# Altium project trusted_io_dvt1.PrjPcb (part 2 of 2)

## Sheet 04_io.SchDoc
size B
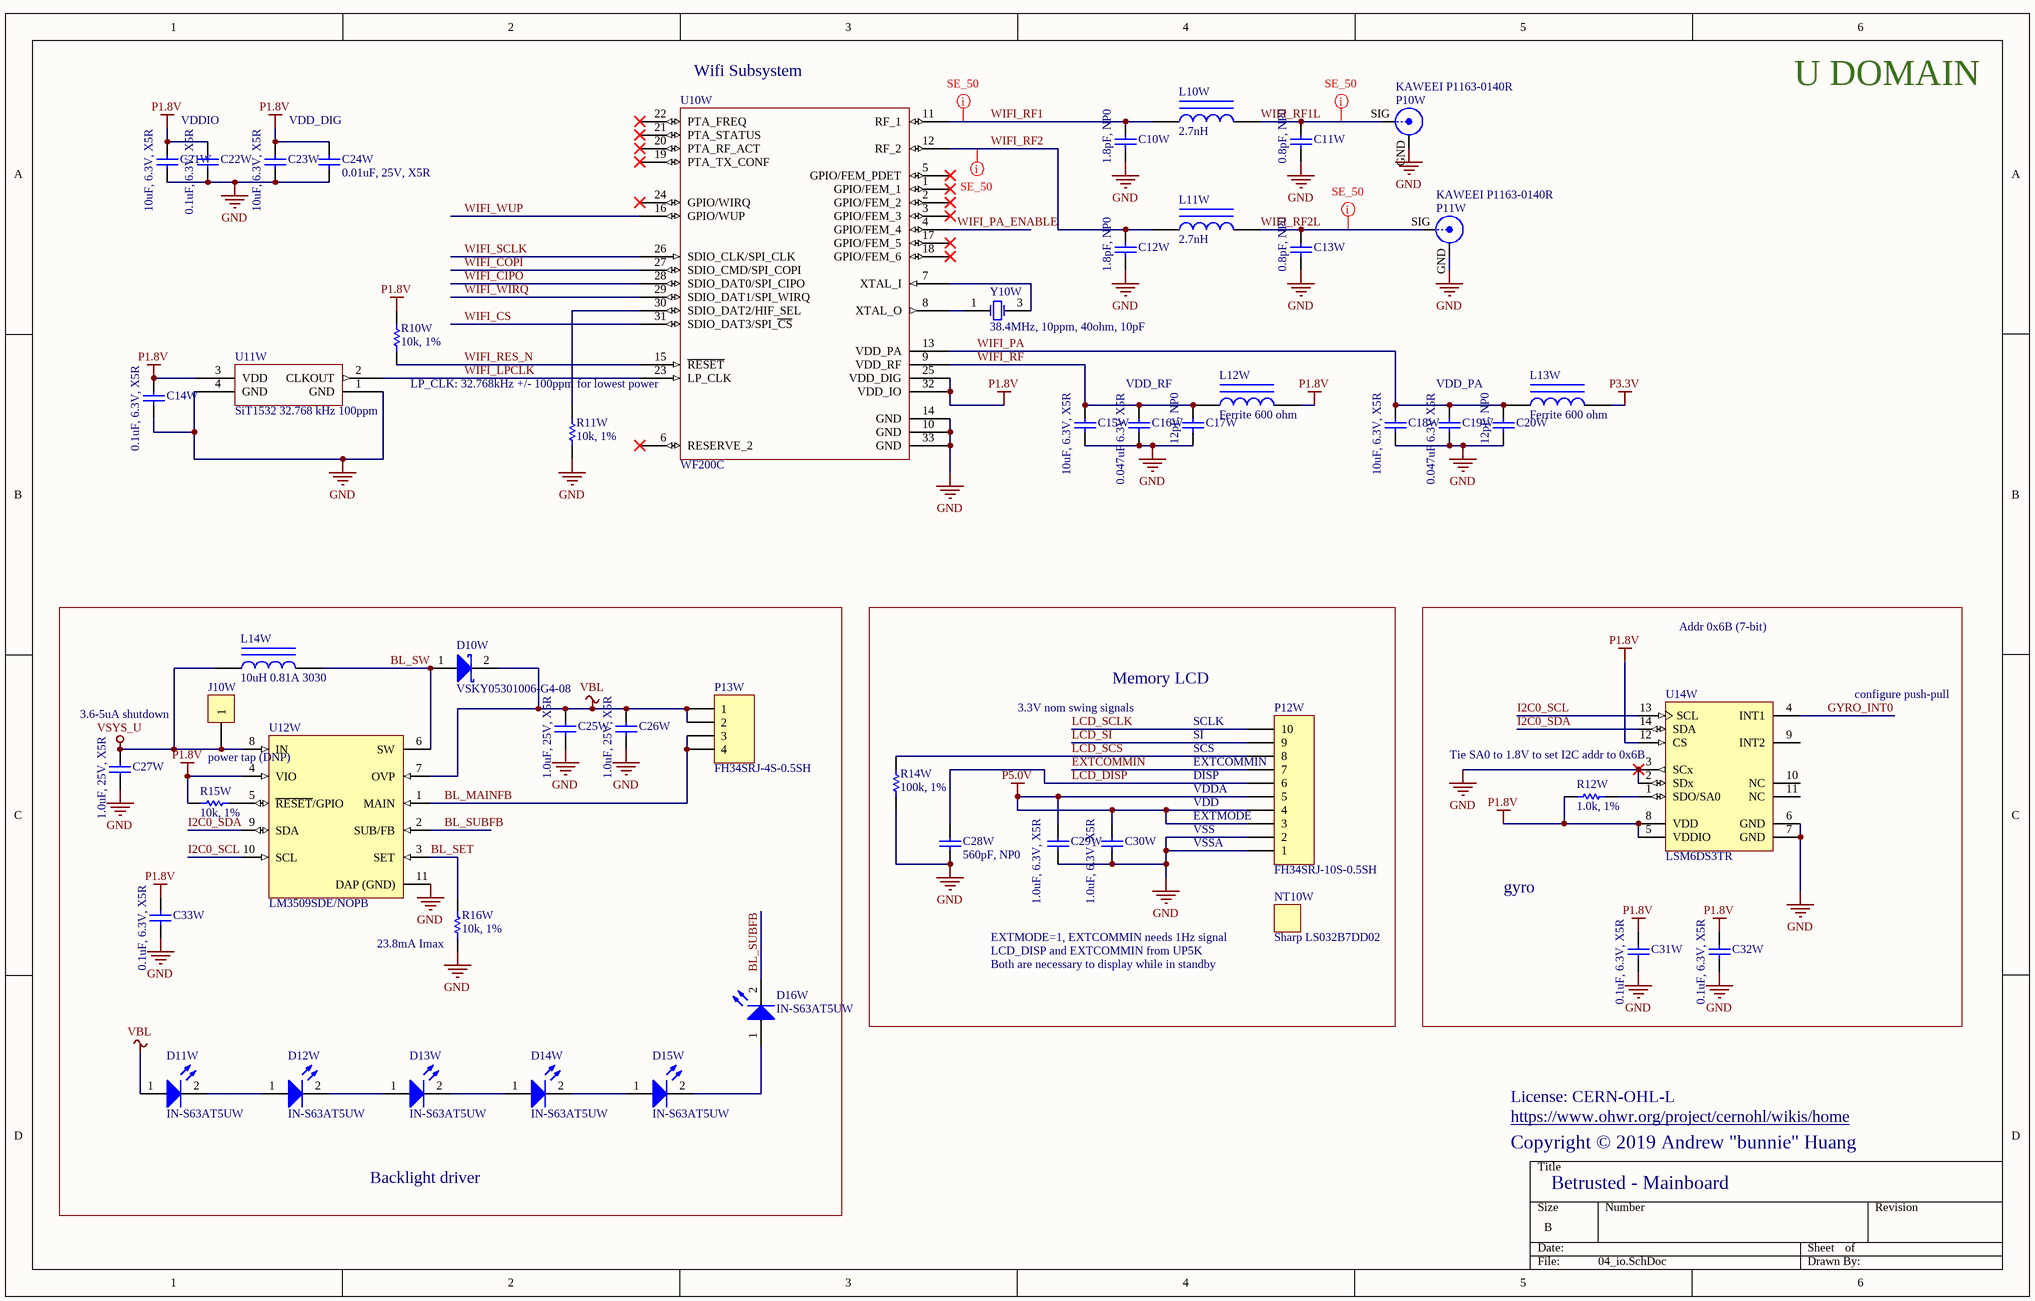
[diagram p5: 04_io.SchDoc]

### Parts
C10W  1.8pF, NP0  [B_CAP0201]
C11W  0.8pF, NP0  [B_CAP0201]
C12W  1.8pF, NP0  [B_CAP0201]
C13W  0.8pF, NP0  [B_CAP0201]
C14W  0.1uF, 6.3V, X5R  [B_CAP0201]
C15W  10uF, 6.3V, X5R  [B_CAP0603]
C16W  0.047uF 6.3V X5R  [B_CAP0201]
C17W  12pF, NP0  [B_CAP0201]
C18W  10uF, 6.3V, X5R  [B_CAP0603]
C19W  0.047uF 6.3V X5R  [B_CAP0201]
C20W  12pF, NP0  [B_CAP0201]
C21W  10uF, 6.3V, X5R  [B_CAP0603]
C22W  0.1uF, 6.3V, X5R  [B_CAP0201]
C23W  10uF, 6.3V, X5R  [B_CAP0603]
C24W  0.01uF, 25V, X5R  [B_RES0201]
C25W  1.0uF, 25V, X5R  [B_CAP0603]
C26W  1.0uF, 25V, X5R  [B_CAP0603]
C27W  1.0uF, 25V, X5R  [B_CAP0603]
C28W  560pF, NP0  [B_RES0201]
C29W  1.0uF, 6.3V, X5R  [B_CAP0201]
C30W  1.0uF, 6.3V, X5R  [B_CAP0201]
C31W  0.1uF, 6.3V, X5R  [B_CAP0201]
C32W  0.1uF, 6.3V, X5R  [B_CAP0201]
C33W  0.1uF, 6.3V, X5R  [B_CAP0201]
D10W  VSKY05301006-G4-08  [B_DIO0402]
D11W  IN-S63AT5UW  [B_DIO0603]
D12W  IN-S63AT5UW  [B_DIO0603]
D13W  IN-S63AT5UW  [B_DIO0603]
D14W  IN-S63AT5UW  [B_DIO0603]
D15W  IN-S63AT5UW  [B_DIO0603]
D16W  IN-S63AT5UW  [B_DIO0603]
J10W  power tap (DNP)  [RESTAP-0603]
L10W  2.7nH  [B_IND0402]
L11W  2.7nH  [B_IND0402]
L12W  Ferrite 600 ohm  [B_IND0603]
L13W  Ferrite 600 ohm  [B_IND0603]
L14W  10uH 0.81A 3030  [B_IND3030_MUR]
NT10W  Sharp LS032B7DD02
P10W  KAWEEI P1163-0140R  [HRS_U.FL]
P11W  KAWEEI P1163-0140R  [HRS_U.FL]
P12W  FH34SRJ-10S-0.5SH  [HRS_FH34SRJ-10S-0.5SH(50)]
P13W  FH34SRJ-4S-0.5SH  [HRS_FH34SRJ-4S-0.5SH(50)]
R10W  10k, 1%  [B_RES0201]
R11W  10k, 1%  [B_RES0201]
R12W  1.0k, 1%  [B_RES0201]
R14W  100k, 1%  [B_RES0201]
R15W  10k, 1%  [B_RES0201]
R16W  10k, 1%  [B_RES0201]
U10W  WF200C  [QFN40P400X400X90_HS-33N]
U11W  SiT1532 32.768 kHz 100ppm  [SiTIME_CSP]
U12W  LM3509SDE/NOPB  [DSC0010A_V]
U14W  LSM6DS3TR  [LGA-14_2500X3000X860_N]
Y10W  38.4MHz, 10ppm, 40ohm, 10pF  [XOSC_3.2_2.5]

### Blocks framed on the sheet
Backlight driver: C25W C26W C27W C33W D10W D11W D12W D13W D14W D15W D16W J10W L14W P13W R15W R16W U12W
Memory LCD: C28W C29W C30W NT10W P12W R14W
gyro: C31W C32W R12W U14W

### Nets
GND: C10W.2 C11W.2 C12W.2 C13W.2 C14W.2 C15W.2 C16W.2 C17W.2 C18W.2 C19W.2 C20W.2 C21W.2 C22W.2 C23W.2 C24W.2 C25W.2 C26W.2 C27W.2 C28W.2 C29W.1 C30W.1 C31W.2 C32W.2 C33W.2 P10W.GND(Y) P11W.GND(Y) P12W.1 P12W.2 R11W.2 R14W.1 R16W.2 U10W.10(GND) U10W.14(GND) U10W.33(GND) U11W.1(GND) U11W.4(GND) U12W.11(DAP_(GND)) U14W.2(SDx) U14W.3(SCx) U14W.6(GND) U14W.7(GND)
P1.8V: C14W.1 C21W.1 C22W.1 C23W.1 C24W.1 C31W.1 C32W.1 C33W.1 L12W.2 R10W.1 R12W.2 R15W.1 U10W.25(VDD_DIG) U10W.32(VDD_IO) U11W.3(VDD) U12W.4(VIO) U14W.5(VDDIO) U14W.8(VDD) U14W.12(CS)
P3.3V: L13W.2
P5.0V: C29W.2 C30W.2 P12W.3 P12W.4 P12W.5
VBL: C25W.1 C26W.1 D10W.2(K) D11W.1(A) P13W.1 P13W.2 U12W.7(OVP)
VSYS_U: C27W.1 J10W.1 L14W.1 U12W.8(IN)
BL_MAINFB: P13W.3 P13W.4 U12W.1(MAIN)
BL_SET: R16W.1 U12W.3(SET)
BL_SUBFB: D16W.2(K) U12W.2(SUB/FB)
BL_SW: D10W.1(A) L14W.2 U12W.6(SW)
EXTCOMMIN: P12W.7
GYRO_INT0: U14W.4(INT1)
I2C0_SCL: U12W.10(SCL) U14W.13(SCL)
I2C0_SDA: U12W.9(SDA) U14W.14(SDA)
LCD_DISP: C28W.1 P12W.6
LCD_SCLK: P12W.10
LCD_SCS: P12W.8 R14W.2
LCD_SI: P12W.9
WIFI_CIPO: U10W.28(SDIO_DAT0/SPI_CIPO)
WIFI_COPI: U10W.27(SDIO_CMD/SPI_COPI)
WIFI_CS: U10W.31(SDIO_DAT3/SPI_~{CS})
WIFI_LPCLK: U10W.23(LP_CLK) U11W.2(CLKOUT)
WIFI_PA: C18W.1 C19W.1 C20W.1 L13W.1 U10W.13(VDD_PA)
WIFI_PA_ENABLE: U10W.4(GPIO/FEM_4)
WIFI_RES_N: R10W.2 U10W.15(~{RESET})
WIFI_RF: C15W.1 C16W.1 C17W.1 L12W.1 U10W.9(VDD_RF)
WIFI_RF1: C10W.1 L10W.1 U10W.11(RF_1)
WIFI_RF1L: C11W.1 L10W.2 P10W.SIG(X)
WIFI_RF2: C12W.1 L11W.1 U10W.12(RF_2)
WIFI_RF2L: C13W.1 L11W.2 P11W.SIG(X)
WIFI_SCLK: U10W.26(SDIO_CLK/SPI_CLK)
WIFI_WIRQ: U10W.29(SDIO_DAT1/SPI_WIRQ)
WIFI_WUP: U10W.16(GPIO/WUP)
NetD11W_2: D11W.2(K) D12W.1(A)
NetD12W_2: D12W.2(K) D13W.1(A)
NetD13W_2: D13W.2(K) D14W.1(A)
NetD14W_2: D14W.2(K) D15W.1(A)
NetD15W_2: D15W.2(K) D16W.1(A)
NetR11W_1: R11W.1 U10W.30(SDIO_DAT2/HIF_SEL)
NetR12W_1: R12W.1 U14W.1(SDO/SA0)
NetR15W_2: R15W.2 U12W.5(~{RESET}/GPIO)
NetU10W_7: U10W.7(XTAL_I) Y10W.3(OSC2)
NetU10W_8: U10W.8(XTAL_O) Y10W.1(OSC1)

Not connected (* = marked no-connect by the designer): U10W 1(GPIO/FEM_1)* 2(GPIO/FEM_2)* 3(GPIO/FEM_3)* 5(GPIO/FEM_PDET)* 6(RESERVE_2)* 17(GPIO/FEM_5)* 18(GPIO/FEM_6)* 19(PTA_TX_CONF)* 20(PTA_RF_ACT)* 21(PTA_STATUS)* 22(PTA_FREQ)* 24(GPIO/WIRQ)*; U14W 9(INT2) 10(NC) 11(NC)

### Layout directives
net class SE_50: WIFI_RF1, WIFI_RF1L, WIFI_RF2, WIFI_RF2L

### Notes on the sheet
- (near U10W) Wifi Subsystem
- U DOMAIN
- VDDIO
- VDD_DIG
- (near U10W) LP_CLK: 32.768kHz +/- 100ppm for lowest power
- VDD_RF
- VDD_PA
- Addr 0x6B (7-bit)
- 3.3V nom swing signals
- configure push-pull
- 3.6-5uA shutdown
- SCLK
- SI
- SCS
- (near P12W) EXTCOMMIN
- DISP
- (near U14W) Tie SA0 to 1.8V to set I2C addr to 0x6B
- VDDA
- VDD
- (near P12W) EXTMODE
- VSS
- VSSA
- (near R16W) 23.8mA Imax
- EXTMODE=1, EXTCOMMIN needs 1Hz signal
- LCD_DISP and EXTCOMMIN from UP5K
- (near NT10W) Both are necessary to display while in standby
- License: CERN-OHL-L
- Copyright © 2019 Andrew "bunnie" Huang
- https://www.ohwr.org/project/cernohl/wikis/home
- Betrusted - Mainboard

### Library data of the parts
C10W C12W = Cap Semi: Capacitor (Semiconductor SIM Model); MPN: GRM0335C1H1R8BA01D; VENDOR: Murata; MYPN: C-1R8-50-NP0-0201
C11W C13W = Cap Semi: Capacitor (Semiconductor SIM Model); MPN: GRM0335C1ER80BA01D; VENDOR: Murata; MYPN: C-0R8-25-NP0-0201
C14W C22W C31W C32W C33W = Cap Semi: as C12F on sheet 01_fpga
C15W C18W C21W C23W = Cap Semi: as C11F on sheet 01_fpga
C16W C19W = Cap Semi: Capacitor (Semiconductor SIM Model); MPN: GRM033C81A473KE05D; VENDOR: Murata; MYPN: C-473-10-X6S-0201
C17W C20W = Cap Semi: Capacitor (Semiconductor SIM Model); MPN: GRM0335C1E120JA01D; VENDOR: Murata; MYPN: C-120-25-NP0-0201
C24W = Cap Semi: as C35F on sheet 01_fpga
C25W C26W C27W = Cap Semi: Capacitor (Semiconductor SIM Model); MPN: CL10A105KA8NNNC; VENDOR: Samsung; MYPN: C-105-25-X5R-0603
C28W = Cap Semi: Capacitor (Semiconductor SIM Model); MPN: GRM0335C1E561JA01D; VENDOR: Murata; MYPN: C-561-25-NP0-0201
C29W C30W = Cap Semi: as C22F on sheet 01_fpga
D10W = Diode 11DQ03: as D? on sheet 03_power; ComponentLink1Description: Manufacturer Link; ComponentLink1URL: http://www.irf.com/; ComponentLink2Description: Datasheet; ComponentLink2URL: http://www.irf.com/product-info/datasheets/data/11dq03.pdf; MPN: VSKY05301006-G4-08
D11W D12W D13W D14W D15W D16W = LED2: White LED, 0603, 900mcd, 0.4mm; MYPN: D-LED-WHT-0603-0.4mm; VENDOR: Inolux; Published: 8-Jun-2000; LatestRevisionDate: 17-Jul-2002; LatestRevisionNote: Re-released for DXP Platform.; PackageVersion: Feb-2002; PackageReference: 3.2X1.6X1.1; Publisher: Altium Limited; MPN: IN-S63AT5UW
J10W = CON1: Connector; MYPN: J-TP-PWRTAP-0603; MPN: DNP; VENDOR: DNP
L10W L11W = Inductor Iron: Magnetic-Core Inductor; MPN: LQW15AN2N7C00; VENDOR: Murata; MYPN: L-LQW15AN2N7C00
L12W L13W = Inductor Iron: as L10F on sheet 01_fpga
L14W = Inductor Iron: Magnetic-Core Inductor; MPN: LQH3NPN100MJRL; VENDOR: Murata; MYPN: L-LQH3NPN100MJRL
NT10W = NOTE: Placeholder for non-board BOM items; MYPN: NT-LCD-LS032B7DD02; MPN: LS032B7DD02; VENDOR: Sharp
P10W P11W = BNC: BNC Elbow Connector; MYPN: U.FL-R-SMT-1(10); LatestRevisionDate: 17-Jul-2002; LatestRevisionNote: Re-released for DXP Platform.; Publisher: Altium Limited; MPN: P1163-0140R; VENDOR: Kaweei
P12W = Header 10: Header, 10-Pin; VENDOR: Hirose; MYPN: J-FH34SRJ-10S-0.5SH(50/99); LatestRevisionDate: 17-Jul-2002; LatestRevisionNote: Re-released for DXP Platform.; Publisher: Altium Limited; MPN: FH34SRJ-10S-0.5SH
P13W = Header 4: 4-pin FPC connector; MPN: FH34SRJ-4S-0.5SH(XX); VENDOR: HRS; MYPN: J-FH34SRJ-4S-0.5SH(99); LatestRevisionDate: 17-Jul-2002; LatestRevisionNote: Re-released for DXP Platform.; Publisher: Altium Limited
R10W R11W R15W R16W = Res1: as R27F on sheet 01_fpga; MPN: ANY
R12W = Res1: Resistor; VENDOR: ANY; MYPN: R-102-1P-1_16W-0201; MPN: ANY
R14W = Res1: as R14F on sheet 01_fpga; MPN: ANY
U10W = WF200C(R): Wifi Network Coprocessor; VENDOR: SiLabs; MYPN: U-WF200C(R); MPN: WF200C
U11W = SiT1532: 10ppm ultra low power 32.768 kHz replacement; MPN: SIT1532AI-J4-DCC-32.768E; VENDOR: SiTime; MYPN: U-SIT1532AX-JX-DCC-32.768X
U12W = LM3509SDE/NOPB: MYPN: U-LM3509SDE/NOPB; VENDOR: TI; MPN: LM3509SDE/NOPB
U14W = LSM6DS3TR: iNEMO Inertial Module: Always-on 3D Accelerometer and 3D Gyroscope, 1.71 to 3.6 V, -40 to 85 degC, 14-Pin LGA, RoHS, Tape and Reel; Sensing Distance: 2|4|6|8|16G; Number of Axis: 3; VENDOR: STMicroelectronics; Output Type: Digital; Lead Finish: GoldOverNickel; Max Processing Temp: 260; Screening Level: Industrial; Typical Supply Current: 1.25Milliamps; Operating Supply Voltage: 1.8volt; MYPN: U-LSM6DS3TR; Type: AccelerometerandGyroscope; Datasheet Version: Rev. 8, 02/2016; Datasheet URL: http://www2.st.com/content/ccc/resource/technical/document/datasheet/a3/f5/4f/ae/8e/44/41/d7/DM00133076.pdf/files/DM00133076.pdf/jcr:content/translations/en.DM00133076.pdf; Mounting: SurfaceMount; Manufacturer URL: http://www.st.com/; Operating Temperature: -40to85C; MPN: LSM6DS3TR
Y10W = XTAL: Crystal Oscillator; MPN: ECS-384-10-33B-CKY-TR; VENDOR: ECS; MYPN: X-38.4000-40OHM-10PF-10PPM; Published: 8-Jun-2000; LatestRevisionDate: 17-Jul-2002; LatestRevisionNote: Re-released for DXP Platform.; PackageReference: R38; Publisher: Altium Limited; PackageDescription: Crystal, Thru-Hole; 2 Leads; Body 3.1 x 8.2 mm (Dia.xH)

## Sheet 05_kbd_pm.SchDoc
size B
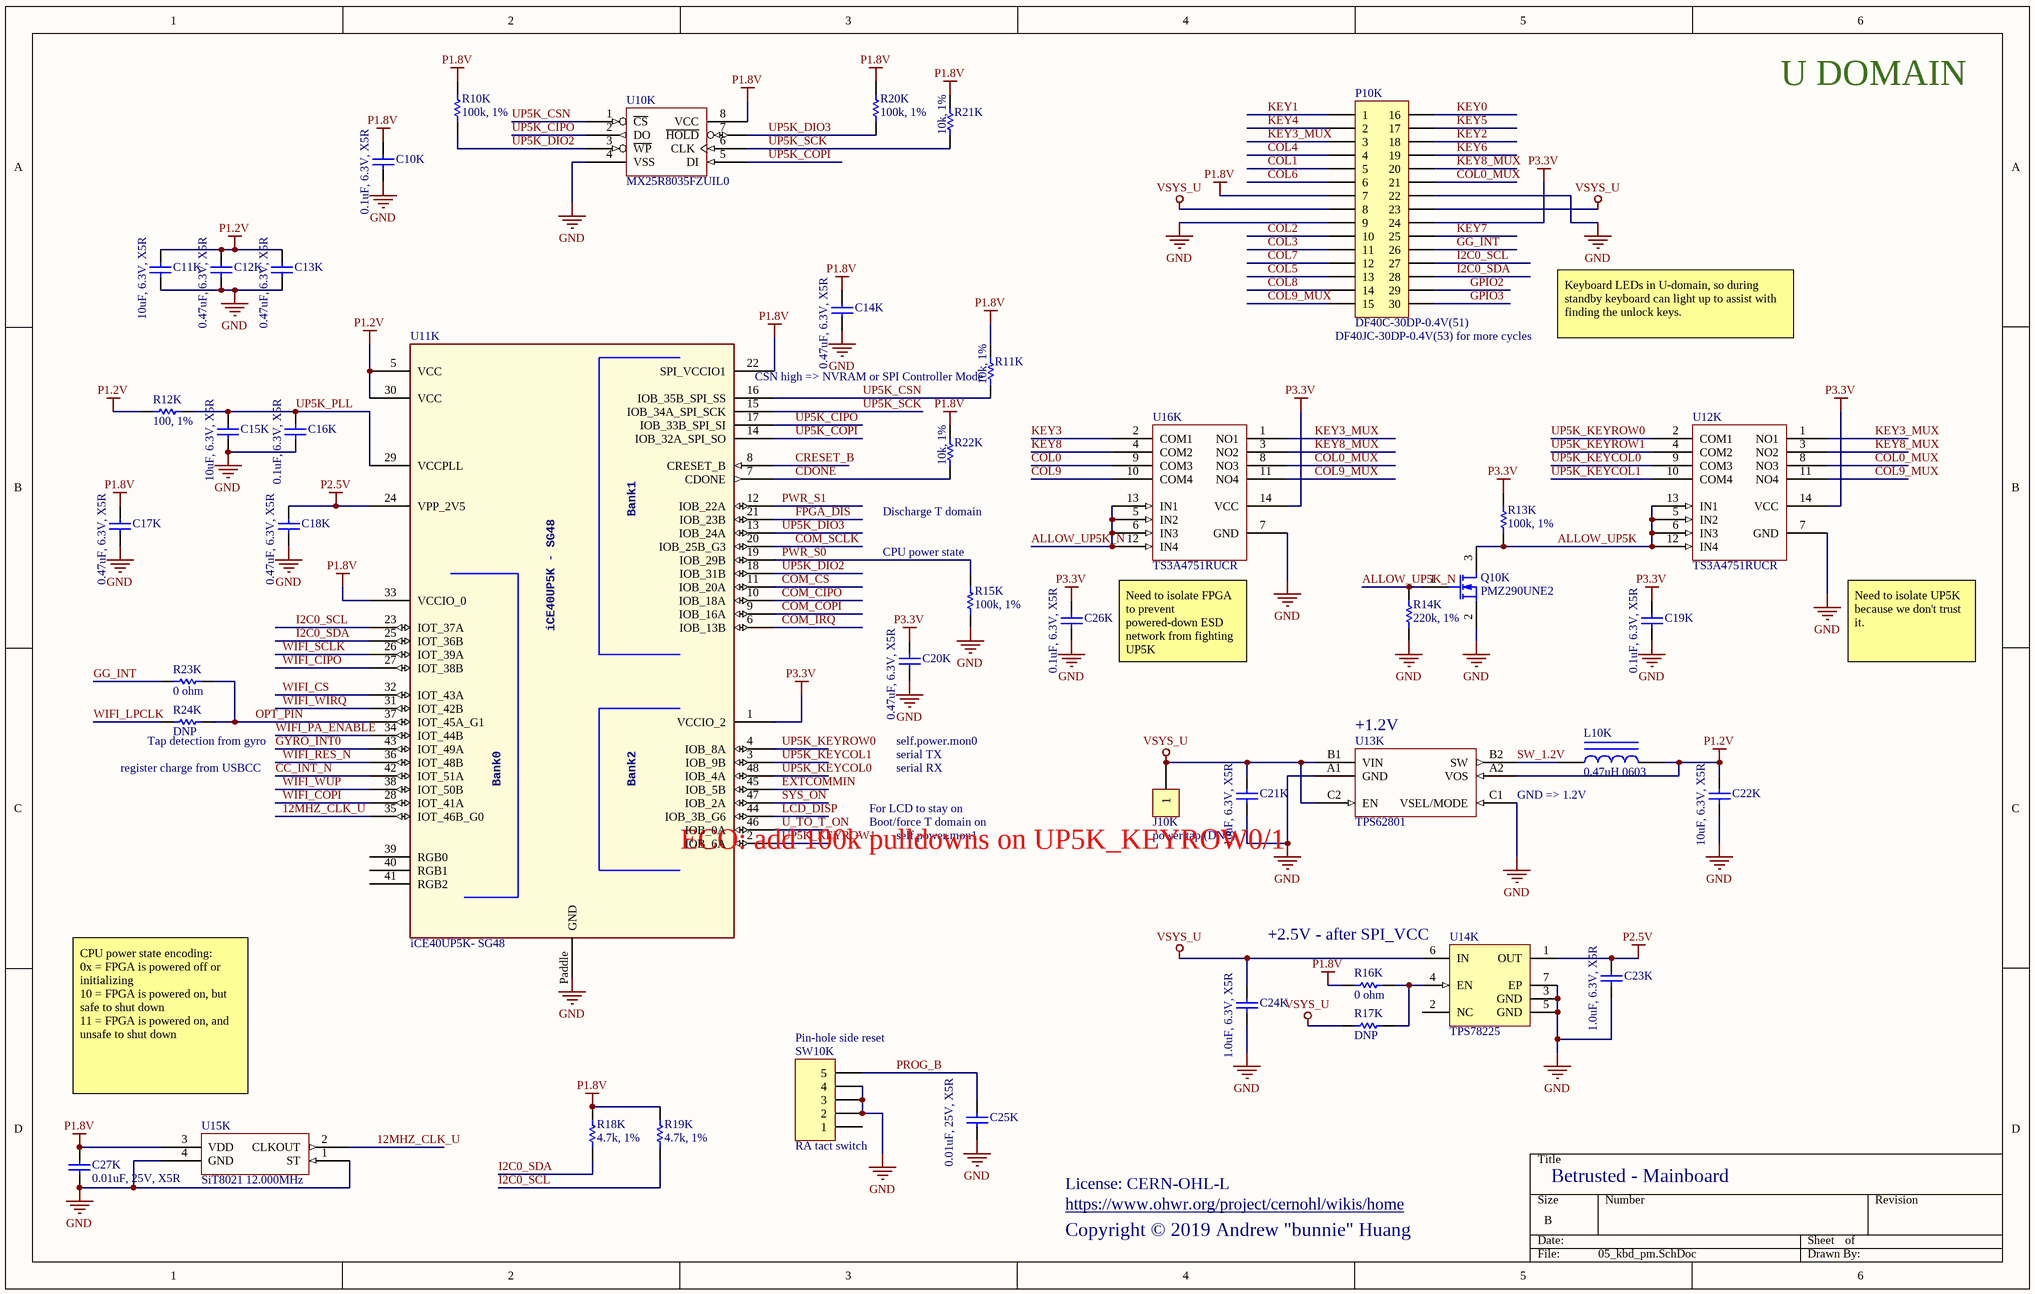
[diagram p6: 05_kbd_pm.SchDoc]

### Parts
C10K  0.1uF, 6.3V, X5R  [B_CAP0201]
C11K  10uF, 6.3V, X5R  [B_CAP0603]
C12K  0.47uF, 6.3V, X5R  [B_CAP0201]
C13K  0.47uF, 6.3V, X5R  [B_CAP0201]
C14K  0.47uF, 6.3V, X5R  [B_CAP0201]
C15K  10uF, 6.3V, X5R  [B_CAP0603]
C16K  0.1uF, 6.3V, X5R  [B_CAP0201]
C17K  0.47uF, 6.3V, X5R  [B_CAP0201]
C18K  0.47uF, 6.3V, X5R  [B_CAP0201]
C19K  0.1uF, 6.3V, X5R  [B_CAP0201]
C20K  0.47uF, 6.3V, X5R  [B_CAP0201]
C21K  10uF, 6.3V, X5R  [B_CAP0603]
C22K  10uF, 6.3V, X5R  [B_CAP0603]
C23K  1.0uF, 6.3V, X5R  [B_CAP0201]
C24K  1.0uF, 6.3V, X5R  [B_CAP0201]
C25K  0.01uF, 25V, X5R  [B_RES0201]
C26K  0.1uF, 6.3V, X5R  [B_CAP0201]
C27K  0.01uF, 25V, X5R  [B_RES0201]
J10K  power tap (DNP)  [RESTAP-0603]
L10K  0.47uH 0603  [B_IND0603]
P10K  DF40C-30DP-0.4V(51)  [HRS_DF40C-30DP-0.4V(51)]
Q10K  PMZ290UNE2  [SOT883]
R10K  100k, 1%  [B_RES0201]
R11K  10k, 1%  [B_RES0201]
R12K  100, 1%  [B_RES0402]
R13K  100k, 1%  [B_RES0201]
R14K  220k, 1%  [B_RES0201]
R15K  100k, 1%  [B_RES0201]
R16K  0 ohm  [B_RES0201]
R17K  DNP  [B_RES0201]
R18K  4.7k, 1%  [B_RES0201]
R19K  4.7k, 1%  [B_RES0201]
R20K  100k, 1%  [B_RES0201]
R21K  10k, 1%  [B_RES0201]
R22K  10k, 1%  [B_RES0201]
R23K  0 ohm  [B_RES0201]
R24K  DNP  [B_RES0201]
SW10K  RA tact switch  [CK_KMS221GPLFS]
U10K  MX25R8035FZUIL0  [USON-8]
U11K  iCE40UP5K- SG48  [UP5K_QFN127P600-8N]
U12K  TS3A4751RUCR  [QFN40P200X200X40-14L]
U13K  TPS62801  [BGA6C35P2X3_70X105X40_NSMD]
U14K  TPS78225  [TI-DRV6-1600X1000TP_V]
U15K  SiT8021 12.000MHz  [SiTIME_CSP]
U16K  TS3A4751RUCR  [QFN40P200X200X40-14L]

### Nets
GND: C10K.2 C11K.2 C12K.2 C13K.2 C14K.2 C15K.2 C16K.2 C17K.2 C18K.2 C19K.2 C20K.2 C21K.2 C22K.2 C23K.2 C24K.2 C25K.2 C26K.2 C27K.2 P10K.9 P10K.22 Q10K.2(S) R14K.1 R15K.1 SW10K.2 SW10K.3 SW10K.4 U10K.4(VSS) U11K.Paddle(GND) U12K.7(GND) U13K.A1(GND) U13K.C1(VSEL/MODE) U14K.3(GND) U14K.5(GND) U14K.7(EP) U15K.1(ST) U15K.4(GND) U16K.7(GND)
P1.2V: C11K.1 C12K.1 C13K.1 C22K.1 L10K.2 R12K.2 U11K.5(VCC) U11K.30(VCC) U13K.A2(VOS)
P1.8V: C10K.1 C14K.1 C17K.1 C27K.1 P10K.7 R10K.2 R11K.1 R16K.1 R18K.2 R19K.2 R20K.2 R21K.1 R22K.1 U10K.8(VCC) U11K.22(SPI_VCCIO1) U11K.33(VCCIO_0) U15K.3(VDD)
P2.5V: C18K.1 C23K.1 U11K.24(VPP_2V5) U14K.1(OUT)
P3.3V: C19K.1 C20K.1 C26K.1 P10K.24 R13K.2 U11K.1(VCCIO_2) U12K.14(VCC) U16K.14(VCC)
VSYS_U: C21K.1 C24K.1 J10K.1 P10K.8 P10K.23 R17K.1 U13K.B1(VIN) U13K.C2(EN) U14K.6(IN)
12MHZ_CLK_U: U11K.35(IOT_46B_G0) U15K.2(CLKOUT)
ALLOW_UP5K: Q10K.3(D) R13K.1 U12K.5(IN2) U12K.6(IN3) U12K.12(IN4) U12K.13(IN1)
ALLOW_UP5K_N: Q10K.1(G) R14K.2 U16K.5(IN2) U16K.6(IN3) U16K.12(IN4) U16K.13(IN1)
CC_INT_N: U11K.42(IOT_51A)
CDONE: R22K.2 U11K.7(CDONE)
COL0: U16K.9(COM3)
COL0_MUX: P10K.21 U12K.8(NO3) U16K.8(NO3)
COL1: P10K.5
COL2: P10K.10
COL3: P10K.11
COL4: P10K.4
COL5: P10K.13
COL6: P10K.6
COL7: P10K.12
COL8: P10K.14
COL9: U16K.10(COM4)
COL9_MUX: P10K.15 U12K.11(NO4) U16K.11(NO4)
COM_CIPO: U11K.10(IOB_18A)
COM_COPI: U11K.9(IOB_16A)
COM_CS: U11K.11(IOB_20A)
COM_IRQ: U11K.6(IOB_13B)
COM_SCLK: U11K.20(IOB_25B_G3)
CRESET_B: U11K.8(CRESET_B)
EXTCOMMIN: U11K.45(IOB_5B)
FPGA_DIS: U11K.21(IOB_23B)
GG_INT: P10K.26 R23K.1
GPIO2: P10K.29
GPIO3: P10K.30
GYRO_INT0: U11K.43(IOT_49A)
I2C0_SCL: P10K.27 R19K.1 U11K.23(IOT_37A)
I2C0_SDA: P10K.28 R18K.1 U11K.25(IOT_36B)
KEY0: P10K.16
KEY1: P10K.1
KEY2: P10K.18
KEY3: U16K.2(COM1)
KEY3_MUX: P10K.3 U12K.1(NO1) U16K.1(NO1)
KEY4: P10K.2
KEY5: P10K.17
KEY6: P10K.19
KEY7: P10K.25
KEY8: U16K.4(COM2)
KEY8_MUX: P10K.20 U12K.3(NO2) U16K.3(NO2)
LCD_DISP: U11K.44(IOB_3B_G6)
OPT_PIN: R23K.2 R24K.2 U11K.37(IOT_45A_G1)
PROG_B: C25K.1 SW10K.5
PWR_S0: R15K.2 U11K.19(IOB_29B)
PWR_S1: U11K.12(IOB_22A)
SW_1.2V: L10K.1 U13K.B2(SW)
SYS_ON: U11K.47(IOB_2A)
U_TO_T_ON: U11K.46(IOB_0A)
UP5K_CIPO: U10K.2(DO) U11K.17(IOB_33B_SPI_SI)
UP5K_COPI: U10K.5(DI) U11K.14(IOB_32A_SPI_SO)
UP5K_CSN: R11K.2 U10K.1(~{CS}) U11K.16(IOB_35B_SPI_SS)
UP5K_DIO2: R10K.1 U10K.3(~{WP}) U11K.18(IOB_31B)
UP5K_DIO3: R20K.1 U10K.7(~{HOLD}) U11K.13(IOB_24A)
UP5K_KEYCOL0: U11K.48(IOB_4A) U12K.9(COM3)
UP5K_KEYCOL1: U11K.3(IOB_9B) U12K.10(COM4)
UP5K_KEYROW0: U11K.4(IOB_8A) U12K.2(COM1)
UP5K_KEYROW1: U11K.2(IOB_6A) U12K.4(COM2)
UP5K_PLL: C15K.1 C16K.1 R12K.1 U11K.29(VCCPLL)
UP5K_SCK: R21K.2 U10K.6(CLK) U11K.15(IOB_34A_SPI_SCK)
WIFI_CIPO: U11K.27(IOT_38B)
WIFI_COPI: U11K.28(IOT_41A)
WIFI_CS: U11K.32(IOT_43A)
WIFI_LPCLK: R24K.1
WIFI_PA_ENABLE: U11K.34(IOT_44B)
WIFI_RES_N: U11K.36(IOT_48B)
WIFI_SCLK: U11K.26(IOT_39A)
WIFI_WIRQ: U11K.31(IOT_42B)
WIFI_WUP: U11K.38(IOT_50B)
NetR16K_2: R16K.2 R17K.2 U14K.4(EN)

Not connected (* = marked no-connect by the designer): SW10K 1; U11K 39(RGB0) 40(RGB1) 41(RGB2); U14K 2(NC)

### Notes on the sheet
- U DOMAIN
- (near P10K) DF40JC-30DP-0.4V(53) for more cycles
- Keyboard LEDs in U-domain, so during standby keyboard can light up to assist with finding the unlock keys.
- (near R11K) CSN high => NVRAM or SPI Controller Mode
- (near R15K) CPU power state
- (near R22K) Discharge T domain
- Need to isolate FPGA to prevent powered-down ESD network from fighting UP5K
- Need to isolate UP5K because we don't trust it.
- (near R24K) register charge from USBCC
- (near R24K) Tap detection from gyro
- self.power.mon0
- serial TX
- serial RX
- (near U13K) +1.2V
- Boot/force T domain on
- For LCD to stay on
- self.power.mon1
- GND => 1.2V
- (near U11K) ECO: add 100k pulldowns on UP5K_KEYROW0/1
- (near U14K) +2.5V - after SPI_VCC
- (near SW10K) Pin-hole side reset
- CPU power state encoding:
  0x = FPGA is powered off or initializing
  10 = FPGA is powered on, but safe to shut down
  11 = FPGA is powered on, and unsafe to shut down
- Betrusted - Mainboard
- License: CERN-OHL-L
- Copyright © 2019 Andrew "bunnie" Huang
- https://www.ohwr.org/project/cernohl/wikis/home
- (in symbol iCE40UP5K- SG48) Bank1; iCE40UP5K - SG48; Bank0; Bank2

### Library data of the parts
C10K C16K C19K C26K = Cap Semi: Capacitor (Semiconductor SIM Model); MPN: CL03A104KQ3NNNC; VENDOR: Samsung; MYPN: C-104-6p3-X5R-0201
C11K C15K C21K C22K = Cap Semi: Capacitor (Semiconductor SIM Model); MPN: CL10A106MQ8NNNC; VENDOR: Samsung; MYPN: C-106-6.3-X5R-0603
C12K C13K C14K C17K C18K C20K = Cap Semi: Capacitor (Semiconductor SIM Model); MPN: CL03A474KQ3NNNH; VENDOR: Samsung; MYPN: C-474-6p3-X5R-0201
C23K C24K = Cap Semi: Capacitor (Semiconductor SIM Model); MPN: GRM033R60J105MEA2D; VENDOR: Murata; MYPN: C-105-6p3-X5R-0201
C25K C27K = Cap Semi: Capacitor (Semiconductor SIM Model); MPN: GRM033R61E103KA12D; VENDOR: Murata; MYPN: C-103-25-X5R-0201
J10K = CON1: Connector; MYPN: J-TP-PWRTAP-0603; MPN: DNP; VENDOR: DNP
L10K = Inductor Iron: Magnetic-Core Inductor; MPN: TFM160808ALC-R47MTAA; VENDOR: TDK; MYPN: L-TFM160808ALC-R47MTAA
P10K = Header 15X2A: Header, 15-Pin, Dual row; MYPN: J-DF40C-30DP-0.4V(51) or DF40JC-30DP-0.4V(53); VENDOR: Hirose; System: Connector; LatestRevisionDate: 17-Jul-2002; LatestRevisionNote: Re-released for DXP Platform.; Publisher: Altium Limited; MPN: DF40C-30DP-0.4V(51)
Q10K = MOSFET-N: N-Channel MOSFET; VENDOR: Nexperia; MYPN: Q-PMZ290UNE2; Published: 8-Jun-2000; LatestRevisionDate: 17-Jul-2002; LatestRevisionNote: Re-released for DXP Platform.; PackageVersion: 1995/1996; PackageReference: E3; Publisher: Altium Limited; MPN: PMZ290UNE2
R10K R13K R15K R20K = Res1: Resistor; VENDOR: ANY; MYPN: R-104-1P-1_16W-0201; MPN: ANY
R11K R21K R22K = Res1: Resistor; VENDOR: ANY; MYPN: R-103-1P-1_16W-0201; MPN: ANY
R12K = Res1: Resistor; VENDOR: ANY; MYPN: R-101-1P-1_16W-0402; MPN: ANY
R14K = Res1: Resistor; VENDOR: ANY; MYPN: R-224-1P-1_16W-0201; MPN: ANY
R16K R23K = Res1: Resistor; VENDOR: ANY; MYPN: R-0R0-1P-1_16W-0201; MPN: ANY
R17K R24K = Res1: Resistor; VENDOR: ANY; MYPN: DNP; MPN: ANY
R18K R19K = Res1: Resistor; VENDOR: ANY; MYPN: R-472-1P-1_16W-0201; MPN: ANY
SW10K = Header 5: MPN: KMS221GPLFS; VENDOR: C&K; MYPN: SW-KMS221GPLFS; LatestRevisionDate: 17-Jul-2002; LatestRevisionNote: Re-released for DXP Platform.; Publisher: Altium Limited
U10K = EN25P05-50GCP: 64Mbit SPI NOR FLASH; MYPN: UMX25R8035FZUIL0; VENDOR: Macronix; MPN: MX25R8035FZUIL0
U11K = iCE40UP5K- SG48: MPN: ICE40UP5K-SG48I; MYPN: U-ICE40UP5K-SG48I; VENDOR: Lattice
U12K U16K = TS3A4751RGYR: 0.9 ohm low voltage, single supply, 4-channel SPST analog switch; MYPN: U-TS3A4751RUCR; VENDOR: TI; MPN: TS3A4751RUCR
U13K = TPS62801: Buck regulator, 4MHz, 0.6A, 0.8V-1.55V, low Iq; MPN: TPS62801YKAT; VENDOR: TI; MYPN: U-TPS62801YKA(T/R)
U14K = TI-TPS78225-Q1DRV6-1600X1000TP: 500nA Iq, 150mA LDO; MPN: TPS78225DRVT; VENDOR: TI; MYPN: U-TPS78225DRV(T/R)
U15K = SiT8021: 1 to 26 MHz micropower oscillator; MPN: SIT8021AI-J4-18S-12.000000E; VENDOR: SiTime; MYPN: U-SIT8021AI-J4-18S-12.000000E

## Sheet 06_rng.SchDoc
size A
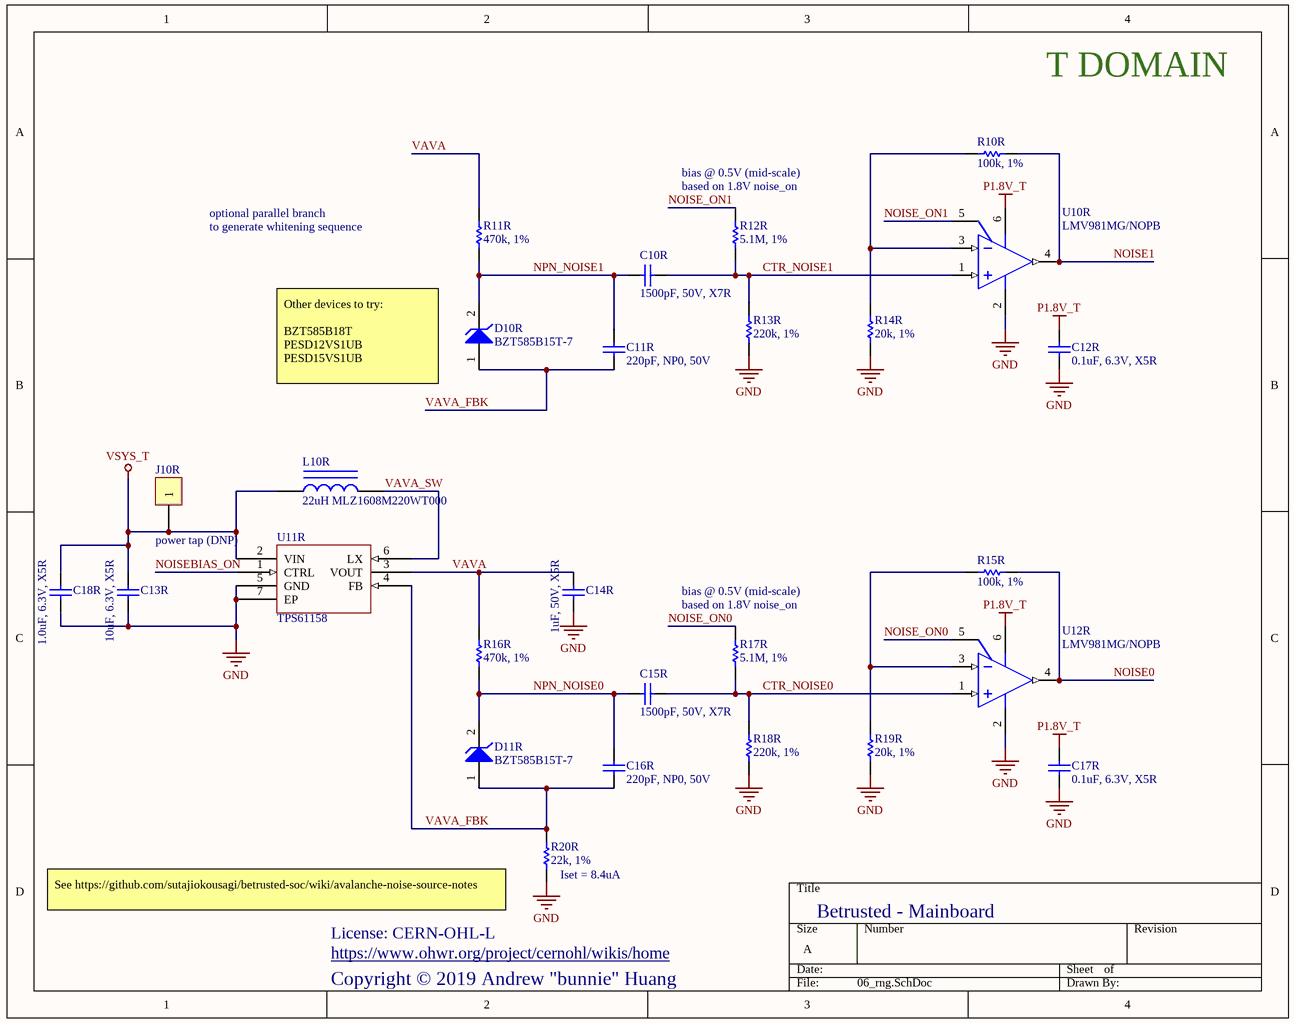
[diagram p7: 06_rng.SchDoc]

### Parts
C10R  1500pF, 50V, X7R  [B_CAP0402]
C11R  220pF, NP0, 50V  [B_CAP0402]
C12R  0.1uF, 6.3V, X5R  [B_CAP0201]
C13R  10uF, 6.3V, X5R  [B_CAP0603]
C14R  1uF, 50V, X5R  [B_CAP0603]
C15R  1500pF, 50V, X7R  [B_CAP0402]
C16R  220pF, NP0, 50V  [B_CAP0402]
C17R  0.1uF, 6.3V, X5R  [B_CAP0201]
C18R  1.0uF, 6.3V, X5R  [B_CAP0201]
D10R  BZT585B15T-7  [SOD523]
D11R  BZT585B15T-7  [SOD523]
J10R  power tap (DNP)  [RESTAP-0603]
L10R  22uH MLZ1608M220WT000  [INDC1608AN]
R10R  100k, 1%  [B_RES0201]
R11R  470k, 1%  [B_RES0402]
R12R  5.1M, 1%  [B_RES0402]
R13R  220k, 1%  [B_RES0201]
R14R  20k, 1%  [B_RES0201]
R15R  100k, 1%  [B_RES0201]
R16R  470k, 1%  [B_RES0402]
R17R  5.1M, 1%  [B_RES0402]
R18R  220k, 1%  [B_RES0201]
R19R  20k, 1%  [B_RES0201]
R20R  22k, 1%  [B_RES0402]
U10R  LMV981MG/NOPB  [DCK0006A_N]
U11R  TPS61158  [SON65P200X80_HS-7N]
U12R  LMV981MG/NOPB  [DCK0006A_N]

### Nets
GND: C12R.1 C13R.2 C14R.2 C17R.1 C18R.1 R13R.1 R14R.1 R18R.1 R19R.1 R20R.1 U10R.2(GND) U11R.5(GND) U11R.7(EP) U12R.2(GND)
P1.8V_T: C12R.2 C17R.2 U10R.6(VDD) U12R.6(VDD)
VSYS_T: C13R.1 C18R.2 J10R.1 L10R.1 U11R.2(VIN)
CTR_NOISE0: C15R.2 R17R.1 R18R.2 U12R.1(IN+)
CTR_NOISE1: C10R.2 R12R.1 R13R.2 U10R.1(IN+)
NOISE0: R15R.1 U12R.4(OUT)
NOISE1: R10R.1 U10R.4(OUT)
NOISE_ON0: R17R.2 U12R.5(~{SHDN})
NOISE_ON1: R12R.2 U10R.5(~{SHDN})
NOISEBIAS_ON: U11R.1(CTRL)
NPN_NOISE0: C15R.1 C16R.2 D11R.2(K) R16R.1
NPN_NOISE1: C10R.1 C11R.2 D10R.2(K) R11R.1
VAVA: C14R.1 R11R.2 R16R.2 U11R.3(VOUT)
VAVA_FBK: C11R.1 C16R.1 D10R.1(A) D11R.1(A) R20R.2 U11R.4(FB)
VAVA_SW: L10R.2 U11R.6(LX)
NetR10R_2: R10R.2 R14R.2 U10R.3(IN-)
NetR15R_2: R15R.2 R19R.2 U12R.3(IN-)

### Notes on the sheet
- T DOMAIN
- optional parallel branch
- to generate whitening sequence
- (near R12R) bias @ 0.5V (mid-scale)
- (near R12R) based on 1.8V noise_on
- Other devices to try:
  BZT585B18T
  PESD12VS1UB
  PESD15VS1UB
- (near R17R) bias @ 0.5V (mid-scale)
- (near R17R) based on 1.8V noise_on
- (near R20R) See https://github.com/sutajiokousagi/betrusted-soc/wiki/avalanche-noise-source-notes
- (near R20R) Iset = 8.4uA
- License: CERN-OHL-L
- https://www.ohwr.org/project/cernohl/wikis/home
- Betrusted - Mainboard
- Copyright © 2019 Andrew "bunnie" Huang

### Library data of the parts
C10R C15R = Cap Semi: Capacitor (Semiconductor SIM Model); MPN: CL05B152KB5NNNC; VENDOR: Samsung; MYPN: C-152-50-X7R-0402
C11R C16R = Cap Semi: Capacitor (Semiconductor SIM Model); MPN: CL05C221JB5NNNC; VENDOR: Samsung; MYPN: C-221-50-NP0-0402
C12R C17R = Cap Semi: as C10K on sheet 05_kbd_pm
C13R = Cap Semi: as C11K on sheet 05_kbd_pm
C14R = Cap Semi: Capacitor (Semiconductor SIM Model); MPN: CL10A105KB8NNNC; VENDOR: Samsung; MYPN: C-105-50-X5R-0603
C18R = Cap Semi: as C23K on sheet 05_kbd_pm
D10R D11R = D Zener: Zener Diode; MYPN: D-Z-15V-SOD523; VENDOR: Diodes Inc; Published: 8-Jun-2000; LatestRevisionDate: 17-Jul-2002; LatestRevisionNote: Re-released for DXP Platform.; PackageReference: DIODE-0.7; Publisher: Altium Limited; PackageDescription: Diode, Thru-Hole; 2 Leads; 0.7 in Pin Spacing; MPN: BZT585B15T-7
J10R = CON1: Connector; MYPN: J-TP-PWRTAP-0603; MPN: DNP; VENDOR: DNP
L10R = Inductor Iron: Magnetic-Core Inductor; VENDOR: TDK; MYPN: L-MLZ1608M220WT000; MPN: MLZ1608M220WT000
R10R R15R = Res1: as R10K on sheet 05_kbd_pm; MPN: ANY
R11R R16R = Res1: Resistor; VENDOR: ANY; MYPN: R-474-1P-1_16W-0402; MPN: ANY
R12R R17R = Res1: Resistor; MPN: RMCF0402FT5M10; VENDOR: Stackpole; MYPN: R-515-1P-1_16W-0402
R13R R18R = Res1: as R14K on sheet 05_kbd_pm; MPN: ANY
R14R R19R = Res1: Resistor; VENDOR: ANY; MYPN: R-203-1P-1_16W-0201; MPN: ANY
R20R = Res1: Resistor; VENDOR: ANY; MYPN: R-223-1P-1_16W-0402; MPN: ANY
U10R U12R = CMP-0055-01099-3: Single 1.8V, RRIO Operational Amplifiers with Shutdown, 6-pin SC-70, Pb-Free; PowerWise: N; PackageTopMarking: A77*XTT; VENDOR: Texas Instruments; ComponentLink1URL: http://www.ti.com/general/docs/lit/getliterature.tsp?genericPartNumber=LMV981-N&fileType=pdf; PackageDescription: Molded SC-70, 2 x 1.25 x .9mm, 6 Lead, 0.65mm Pitch; RoHS: Y; PinCount: 6; ComponentLink1Description: Datasheet URL; CompType: Amplifiers; Package Reference: DCK0006A; MPN: LMV981MG/NOPB
U11R = TPS61158: 30V WLED driver with integrated power diode; MPN: TPS61158DRVR; VENDOR: TI; MYPN: U-TPS61158DRVR

## Sheet 07_ux.SchDoc
size B
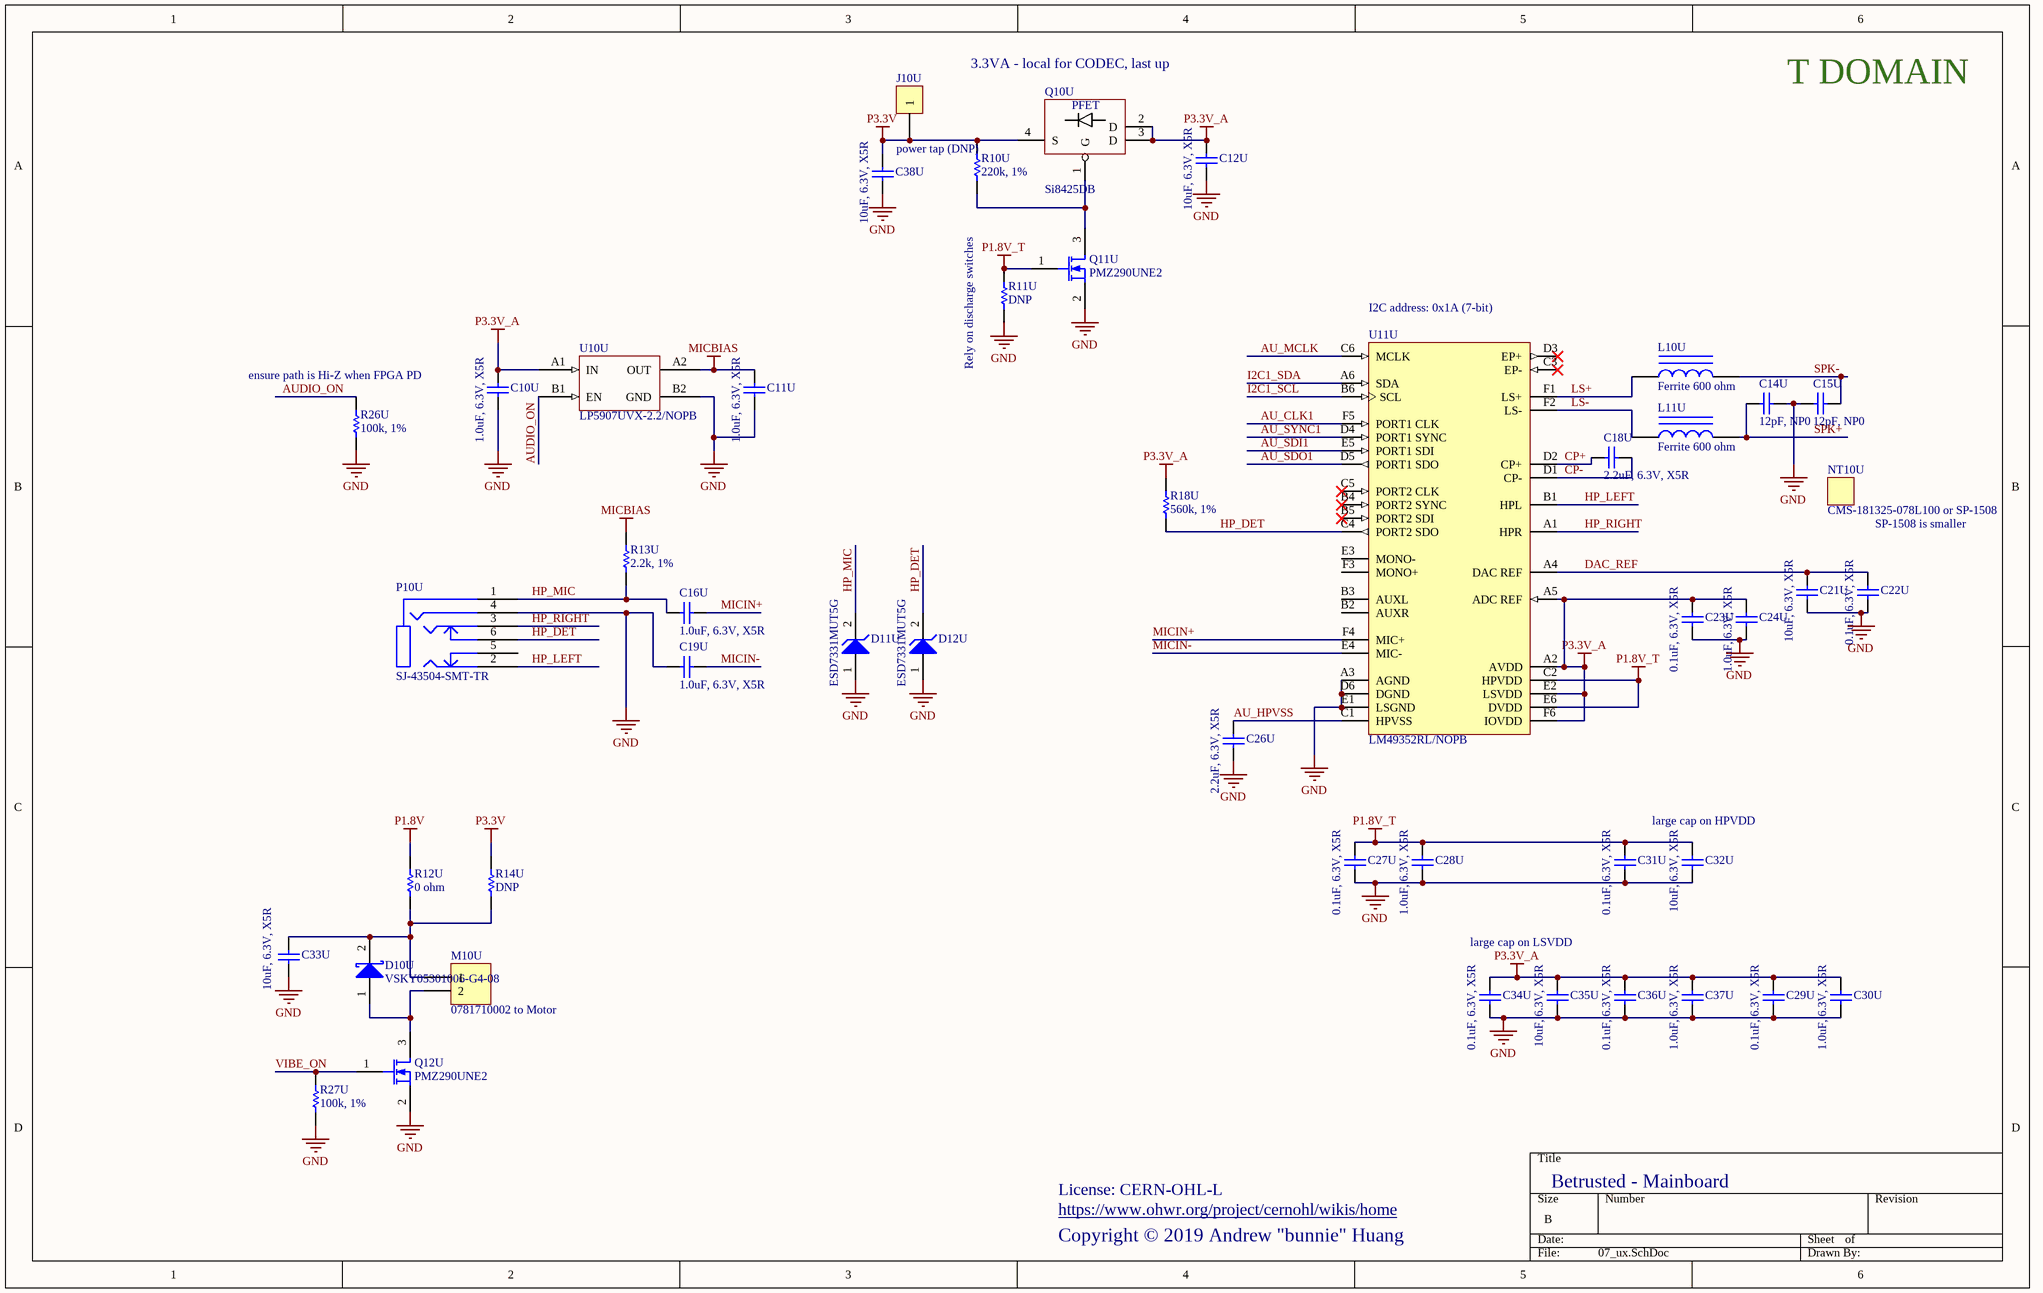
[diagram p8: 07_ux.SchDoc]

### Parts
C10U  1.0uF, 6.3V, X5R  [B_CAP0201]
C11U  1.0uF, 6.3V, X5R  [B_CAP0201]
C12U  10uF, 6.3V, X5R  [B_CAP0603]
C14U  12pF, NP0  [B_CAP0201]
C15U  12pF, NP0  [B_CAP0201]
C16U  1.0uF, 6.3V, X5R  [B_CAP0201]
C18U  2.2uF, 6.3V, X5R  [B_CAP0402]
C19U  1.0uF, 6.3V, X5R  [B_CAP0201]
C21U  10uF, 6.3V, X5R  [B_CAP0603]
C22U  0.1uF, 6.3V, X5R  [B_CAP0201]
C23U  0.1uF, 6.3V, X5R  [B_CAP0201]
C24U  1.0uF, 6.3V, X5R  [B_CAP0201]
C26U  2.2uF, 6.3V, X5R  [B_CAP0402]
C27U  0.1uF, 6.3V, X5R  [B_CAP0201]
C28U  1.0uF, 6.3V, X5R  [B_CAP0201]
C29U  0.1uF, 6.3V, X5R  [B_CAP0201]
C30U  1.0uF, 6.3V, X5R  [B_CAP0201]
C31U  0.1uF, 6.3V, X5R  [B_CAP0201]
C32U  10uF, 6.3V, X5R  [B_CAP0603]
C33U  10uF, 6.3V, X5R  [B_CAP0603]
C34U  0.1uF, 6.3V, X5R  [B_CAP0201]
C35U  10uF, 6.3V, X5R  [B_CAP0603]
C36U  0.1uF, 6.3V, X5R  [B_CAP0201]
C37U  1.0uF, 6.3V, X5R  [B_CAP0201]
C38U  10uF, 6.3V, X5R  [B_CAP0603]
D10U  VSKY05301006-G4-08  [B_DIO0402]
D11U  ESD7331MUT5G  [D_X3DFN2_0201]
D12U  ESD7331MUT5G  [D_X3DFN2_0201]
J10U  power tap (DNP)  [RESTAP-0603]
L10U  Ferrite 600 ohm  [B_IND0603]
L11U  Ferrite 600 ohm  [B_IND0603]
M10U  0781710002 to Motor  [MOLEX_0781710002]
NT10U  CMS-181325-078L100 or SP-1508
P10U  SJ-43504-SMT-TR  [CUI_SJ_43504_SMT_TR_FLIP]
Q10U  Si8425DB  [VISHAY_MICRO_FOOT_4_BUMP]
Q11U  PMZ290UNE2  [SOT883]
Q12U  PMZ290UNE2  [SOT883]
R10U  220k, 1%  [B_RES0201]
R11U  DNP  [B_RES0201]
R12U  0 ohm  [B_RES0201]
R13U  2.2k, 1%  [B_RES0201]
R14U  DNP  [B_RES0201]
R18U  560k, 1%  [B_RES0201]
R26U  100k, 1%  [B_RES0201]
R27U  100k, 1%  [B_RES0201]
U10U  LP5907UVX-2.2/NOPB  [TI_YKE004]
U11U  LM49352RL/NOPB  [YPG0036AWAW]

### Nets
GND: C10U.2 C11U.2 C12U.2 C14U.2 C15U.1 C19U.1 C21U.2 C22U.2 C23U.2 C24U.1 C26U.1 C27U.2 C28U.1 C29U.2 C30U.1 C31U.2 C32U.2 C33U.1 C34U.2 C35U.2 C36U.2 C37U.1 C38U.2 D11U.1(A) D12U.1(A) P10U.4(RING2) Q11U.2(S) Q12U.2(S) R11U.1 R26U.1 R27U.1 U10U.B2(GND) U11U.A3(AGND) U11U.D6(DGND) U11U.E1(LSGND)
MICBIAS: C11U.1 R13U.2 U10U.A2(OUT)
P1.8V: R12U.2
P1.8V_T: C27U.1 C28U.2 C31U.1 C32U.1 Q11U.1(G) R11U.2 U11U.C2(HPVDD) U11U.E6(DVDD)
P3.3V: C38U.1 J10U.1 Q10U.4(S) R10U.2 R14U.1
P3.3V_A: C10U.1 C12U.1 C23U.1 C24U.2 C29U.1 C30U.2 C34U.1 C35U.1 C36U.1 C37U.2 Q10U.2(D) Q10U.3(D) R18U.2 U10U.A1(IN) U11U.A2(AVDD) U11U.A5(ADC_REF) U11U.E2(LSVDD) U11U.F6(IOVDD)
AU_CLK1: U11U.F5(PORT1_CLK)
AU_HPVSS: C26U.2 U11U.C1(HPVSS)
AU_MCLK: U11U.C6(MCLK)
AU_SDI1: U11U.E5(PORT1_SDI)
AU_SDO1: U11U.D5(PORT1_SDO)
AU_SYNC1: U11U.D4(PORT1_SYNC)
AUDIO_ON: R26U.2 U10U.B1(EN)
CP+: C18U.2 U11U.D2(CP+)
CP-: C18U.1 U11U.D1(CP-)
DAC_REF: C21U.1 C22U.1 U11U.A4(DAC_REF)
HP_DET: D12U.2(K) P10U.6(RING1_SW) R18U.1 U11U.C4(PORT2_SDO)
HP_LEFT: P10U.2(TIP) U11U.B1(HPL)
HP_MIC: C16U.1 D11U.2(K) P10U.1(SLEEVE) R13U.1
HP_RIGHT: P10U.3(RING1) U11U.A1(HPR)
I2C1_SCL: U11U.B6(SCL)
I2C1_SDA: U11U.A6(SDA)
LS+: L10U.1 U11U.F1(LS+)
LS-: L11U.1 U11U.F2(LS-)
MICIN+: C16U.2 U11U.F4(MIC+)
MICIN-: C19U.2 U11U.E4(MIC-)
SPK+: C14U.1 L11U.2
SPK-: C15U.2 L10U.2
VIBE_ON: Q12U.1(G) R27U.2
NetC33U_2: C33U.2 D10U.2(K) M10U.1 R12U.1 R14U.2
NetD10U_1: D10U.1(A) M10U.2 Q12U.3(D)
NetQ10U_1: Q10U.1(G) Q11U.3(D) R10U.1

Not connected (* = marked no-connect by the designer): P10U 5(TIP_SW); U11U B2(AUXR) B3(AUXL) B4(PORT2_SYNC)* B5(PORT2_SDI)* C3(EP-)* C5(PORT2_CLK)* D3(EP+)* E3(MONO-) F3(MONO+)

### Notes on the sheet
- 3.3VA - local for CODEC, last up
- T DOMAIN
- Rely on discharge switches
- (near U11U) I2C address: 0x1A (7-bit)
- (near R26U) ensure path is Hi-Z when FPGA PD
- SP-1508 is smaller
- large cap on HPVDD
- large cap on LSVDD
- License: CERN-OHL-L
- Copyright © 2019 Andrew "bunnie" Huang
- https://www.ohwr.org/project/cernohl/wikis/home
- Betrusted - Mainboard
- (in symbol Si8425DB) PFET

### Library data of the parts
C10U C11U C16U C19U = Cap Semi: Capacitor (Semiconductor SIM Model); MPN: GRM033R60J105MEA2D; VENDOR: Murata; MYPN: C-105-6p3-X5R-0603
C12U C21U C32U C33U C35U C38U = Cap Semi: as C11K on sheet 05_kbd_pm
C14U C15U = Cap Semi: Capacitor (Semiconductor SIM Model); MPN: GRM0335C1E120JA01D; VENDOR: Murata; MYPN: C-120-25-NP0-0201
C18U C26U = Cap Semi: Capacitor (Semiconductor SIM Model); MPN: CL05A225MQ5NNNC; VENDOR: Samsung; MYPN: C-225-6p3-X5R-0402
C22U C23U C27U C29U C31U C34U C36U = Cap Semi: as C10K on sheet 05_kbd_pm
C24U C28U C30U C37U = Cap Semi: as C23K on sheet 05_kbd_pm
D10U = Diode 11DQ03: Schottky Rectifier; MYPN: D-SCHOTTKY-0402-CSP; VENDOR: Vishay; ComponentLink1Description: Manufacturer Link; ComponentLink1URL: http://www.irf.com/; ComponentLink2Description: Datasheet; ComponentLink2URL: http://www.irf.com/product-info/datasheets/data/11dq03.pdf; MPN: VSKY05301006-G4-08
D11U D12U = D Zener: VENDOR: ON Semi; MYPN: D-ESD7331MUT5G; Published: 8-Jun-2000; LatestRevisionDate: 17-Jul-2002; LatestRevisionNote: Re-released for DXP Platform.; PackageReference: DIODE-0.7; Publisher: Altium Limited; PackageDescription: Diode, Thru-Hole; 2 Leads; 0.7 in Pin Spacing; MPN: ESD7331MUT5G
J10U = CON1: Connector; MYPN: J-TP-PWRTAP-0603; MPN: DNP; VENDOR: DNP
L10U L11U = Inductor Iron: Magnetic-Core Inductor; MPN: BLM18AG601SN1D; VENDOR: Murata; MYPN: L-BLM18AG601SN1D
M10U = Header 2: Vibration motor, mid-mount 10mm; VENDOR: Molex; MYPN: J-0781710002; LatestRevisionDate: 17-Jul-2002; LatestRevisionNote: Re-released for DXP Platform.; Publisher: Altium Limited; MPN: 0781710002
NT10U = NOTE: Placeholder for non-board BOM items; MYPN: NT-CUI-SPEAKER; VENDOR: CUI or Soberton; MPN: CMS-181325-078L100 or SP-1508
P10U = CUI_3.5MM_STEREO_MIC: Mid mount audio jack; VENDOR: CUI; MYPN: J-3.5MM-MID-CUI; MPN: SJ-43504-SMT-TR
Q10U = Si8425DB: P-channel 20V 6.2A 27mOhm @ -2.5V; MPN: SI8457DB-T1-E1; VENDOR: Vishay Siliconix; MYPN: Q-Si8457
Q11U Q12U = MOSFET-N: as Q10K on sheet 05_kbd_pm; Published: 8-Jun-2000; LatestRevisionDate: 17-Jul-2002; LatestRevisionNote: Re-released for DXP Platform.; PackageVersion: 1995/1996; PackageReference: E3; Publisher: Altium Limited; MPN: PMZ290UNE2
R10U = Res1: as R14K on sheet 05_kbd_pm; MPN: ANY
R11U R14U = Res1: Resistor; VENDOR: ANY; MYPN: DNP; MPN: ANY
R12U = Res1: as R16K on sheet 05_kbd_pm; MPN: ANY
R13U = Res1: Resistor; VENDOR: ANY; MYPN: R-222-1P-1_16W-0201; MPN: ANY
R18U = Res1: Resistor; VENDOR: ANY; MYPN: R-564-1P-1_16W-0201; MPN: ANY
R26U R27U = Res1: as R10K on sheet 05_kbd_pm; MPN: ANY
U10U = LP5907UVX: Ultra low-noise 250mA LDO for RF and analog in DSBGA; VENDOR: TI; MYPN: ULP5907UVX-2.2; MPN: LP5907UVX-2.2/NOPB
U11U = AMP-AUDA-LM49352-36: MYPN: U-LM49352RL/NOPB; VENDOR: TI; MPN: LM49352RL/NOPB

## Nets that join several sheets
GND: 01_fpga (151 pins), 02_memory (21 pins), 03_power (75 pins), 04_io (41 pins), 05_kbd_pm (37 pins), 06_rng (14 pins), 07_ux (35 pins)
P1.2V: 03_power (R19P.1), 05_kbd_pm (9 pins)
P1.8V: 01_fpga (C37F.2 P11F.16 P12F.9), 03_power (9 pins), 04_io (19 pins), 05_kbd_pm (17 pins), 07_ux (R12U.2)
P1.8V_SBY: 01_fpga (U16F.A2 U17F.A2), 02_memory (15 pins)
P1.8V_T: 01_fpga (55 pins), 02_memory (7 pins), 06_rng (C12R.2 C17R.2 U10R.6 U12R.6), 07_ux (8 pins)
P3.3V: 01_fpga (P11F.9), 03_power (C24P.1 L12P.2 U13P.A2), 04_io (L13W.2), 05_kbd_pm (8 pins), 07_ux (5 pins)
P3.3V_A: 01_fpga (20 pins), 03_power (R35P.2), 07_ux (18 pins)
P5.0V: 03_power (C28P.1 C29P.1 U15P.B2), 04_io (5 pins)
PACK_P: 01_fpga (P11F.4 P11F.5 P11F.6), 03_power (5 pins)
VBAT: 01_fpga (C66F.1 U18F.8), 03_power (6 pins)
VBUS: 01_fpga (5 pins), 03_power (14 pins)
VSYS_RAW: 01_fpga (C36F.1 J10F.1 Q10F.4 R10F.2), 02_memory (C19M.1 J10M.1 R14M.1 U13M.B1), 03_power (10 pins)
VSYS_T: 01_fpga (10 pins), 06_rng (5 pins)
VSYS_U: 01_fpga (P11F.20), 03_power (16 pins), 04_io (C27W.1 J10W.1 L14W.1 U12W.8), 05_kbd_pm (9 pins)
ALLOW_UP5K_N: 01_fpga (U11F.B14), 05_kbd_pm (6 pins)
AU_CLK1: 01_fpga (U11F.D12), 07_ux (U11U.F5)
AU_MCLK: 01_fpga (U11F.E12), 07_ux (U11U.C6)
AU_SDI1: 01_fpga (U11F.E13), 07_ux (U11U.E5)
AU_SDO1: 01_fpga (U11F.C13), 07_ux (U11U.D5)
AU_SYNC1: 01_fpga (U11F.D14), 07_ux (U11U.D4)
AUDIO_ON: 01_fpga (U11F.B7), 07_ux (R26U.2 U10U.B1)
CC_ID: 01_fpga (U11F.D18), 03_power (R35P.1 U16P.9)
CC_INT_N: 03_power (R34P.1 U16P.6), 05_kbd_pm (U11K.42)
CHG_TS: 01_fpga (P11F.7), 03_power (R40P.2 R41P.1 TP17P.1 U17P.D3)
COL0: 01_fpga (U11F.B13), 05_kbd_pm (U16K.9)
COL1: 01_fpga (U11F.C18), 05_kbd_pm (P10K.5)
COL2: 01_fpga (U11F.E14), 05_kbd_pm (P10K.10)
COL3: 01_fpga (U11F.D15), 05_kbd_pm (P10K.11)
COL4: 01_fpga (U11F.B18), 05_kbd_pm (P10K.4)
COL5: 01_fpga (U11F.D16), 05_kbd_pm (P10K.13)
COL6: 01_fpga (U11F.D17), 05_kbd_pm (P10K.6)
COL7: 01_fpga (U11F.F13), 05_kbd_pm (P10K.12)
COL8: 01_fpga (U11F.E15), 05_kbd_pm (P10K.14)
COL9: 01_fpga (U11F.A13), 05_kbd_pm (U16K.10)
COM_CIPO: 01_fpga (U11F.P16), 05_kbd_pm (U11K.10)
COM_COPI: 01_fpga (U11F.N18), 05_kbd_pm (U11K.9)
COM_CS: 01_fpga (U11F.T15), 05_kbd_pm (U11K.11)
COM_IRQ: 01_fpga (U11F.M16), 05_kbd_pm (U11K.6)
COM_SCLK: 01_fpga (U11F.R16), 05_kbd_pm (U11K.20)
CRESET_B: 01_fpga (P12F.4 R33F.1), 03_power (R22P.1 U14P.1), 05_kbd_pm (U11K.8)
EXTCOMMIN: 04_io (P12W.7), 05_kbd_pm (U11K.45)
FPGA_DIS: 01_fpga (Q14F.1 Q15F.1 R23F.2), 05_kbd_pm (U11K.21)
GG_INT: 03_power (R18P.2 U11P.A1 U17P.F4), 05_kbd_pm (P10K.26 R23K.1)
GPIO2: 01_fpga (P11F.22 U11F.E16), 05_kbd_pm (P10K.29)
GPIO3: 01_fpga (P11F.12 U11F.G15), 05_kbd_pm (P10K.30)
GYRO_INT0: 04_io (U14W.4), 05_kbd_pm (U11K.43)
I2C0_SCL: 01_fpga (P11F.18), 03_power (U11P.A3 U16P.8 U17P.F5), 04_io (U12W.10 U14W.13), 05_kbd_pm (P10K.27 R19K.1 U11K.23)
I2C0_SDA: 01_fpga (P11F.17), 03_power (U11P.A2 U16P.7 U17P.E4), 04_io (U12W.9 U14W.14), 05_kbd_pm (P10K.28 R18K.1 U11K.25)
I2C1_SCL: 01_fpga (R26F.1 U11F.G2 U18F.3), 07_ux (U11U.B6)
I2C1_SDA: 01_fpga (R25F.1 U11F.F2 U18F.4), 07_ux (U11U.A6)
KEY0: 01_fpga (U11F.A15), 05_kbd_pm (P10K.16)
KEY1: 01_fpga (U11F.A17), 05_kbd_pm (P10K.1)
KEY2: 01_fpga (U11F.A16), 05_kbd_pm (P10K.18)
KEY3: 01_fpga (U11F.A14), 05_kbd_pm (U16K.2)
KEY4: 01_fpga (U11F.C17), 05_kbd_pm (P10K.2)
KEY5: 01_fpga (U11F.B16), 05_kbd_pm (P10K.17)
KEY6: 01_fpga (U11F.B17), 05_kbd_pm (P10K.19)
KEY7: 01_fpga (U11F.C14), 05_kbd_pm (P10K.25)
KEY8: 01_fpga (U11F.B15), 05_kbd_pm (U16K.4)
LCD_DISP: 04_io (C28W.1 P12W.6), 05_kbd_pm (U11K.44)
LCD_SCLK: 01_fpga (U11F.H17), 04_io (P12W.10)
LCD_SCS: 01_fpga (U11F.G17), 04_io (P12W.8 R14W.2)
LCD_SI: 01_fpga (U11F.H18), 04_io (P12W.9)
NOISE0: 01_fpga (U11F.C5), 06_rng (R15R.1 U12R.4)
NOISE1: 01_fpga (U11F.A8), 06_rng (R10R.1 U10R.4)
NOISE_ON0: 01_fpga (U11F.P14), 06_rng (R17R.2 U12R.5)
NOISE_ON1: 01_fpga (U11F.R13), 06_rng (R12R.2 U10R.5)
NOISEBIAS_ON: 01_fpga (U11F.E17), 06_rng (U11R.1)
PROG_B: 01_fpga (P12F.21 R24F.1 U11F.R8 U14F.1), 02_memory (U12M.A4), 03_power (U17P.D4), 05_kbd_pm (C25K.1 SW10K.5)
PWR_S0: 01_fpga (R27F.1 U11F.U6 U16F.C2 U17F.C2), 05_kbd_pm (R15K.2 U11K.19)
PWR_S1: 01_fpga (U11F.L13), 05_kbd_pm (U11K.12)
SPINOR_CIPO: 01_fpga (U11F.K18), 02_memory (J17M.1 U12M.D2)
SPINOR_COPI: 01_fpga (U11F.K17), 02_memory (J12M.1 U12M.D3)
SPINOR_CSN: 01_fpga (U11F.M13), 02_memory (R13M.1 U12M.C2)
SPINOR_DQS: 01_fpga (U11F.R14), 02_memory (U12M.C3)
SPINOR_ECSN: 01_fpga (R30F.2 U11F.L16), 02_memory (U12M.A5)
SPINOR_IO2: 01_fpga (U11F.L14), 02_memory (U12M.C4)
SPINOR_IO3: 01_fpga (U11F.M15), 02_memory (U12M.D4)
SPINOR_IO4: 01_fpga (U11F.L17), 02_memory (U12M.D5)
SPINOR_IO5: 01_fpga (U11F.L18), 02_memory (U12M.E3)
SPINOR_IO6: 01_fpga (U11F.M14), 02_memory (U12M.E2)
SPINOR_IO7: 01_fpga (U11F.N14), 02_memory (U12M.E1)
SPINOR_SCK: 01_fpga (U11F.C8 U11F.C12), 02_memory (J11M.1 U12M.B2)
SPK+: 01_fpga (P11F.23 P11F.24), 07_ux (C14U.1 L11U.2)
SPK-: 01_fpga (P11F.25 P11F.26), 07_ux (C15U.2 L10U.2)
SRAM_A0: 01_fpga (U11F.V12), 02_memory (J13M.1 U10M.A3 U11M.A3)
SRAM_A1: 01_fpga (U11F.M5), 02_memory (U10M.A4 U11M.A4)
SRAM_A2: 01_fpga (U11F.P5), 02_memory (U10M.A5 U11M.A5)
SRAM_A3: 01_fpga (U11F.N4), 02_memory (U10M.B3 U11M.B3)
SRAM_A4: 01_fpga (U11F.V14), 02_memory (U10M.B4 U11M.B4)
SRAM_A5: 01_fpga (U11F.M3), 02_memory (U10M.C3 U11M.C3)
SRAM_A6: 01_fpga (U11F.R17), 02_memory (U10M.C4 U11M.C4)
SRAM_A7: 01_fpga (U11F.U15), 02_memory (U10M.D4 U11M.D4)
SRAM_A8: 01_fpga (U11F.M4), 02_memory (U10M.H5 U11M.H2)
SRAM_A9: 01_fpga (U11F.L6), 02_memory (U10M.H4 U11M.H3)
SRAM_A10: 01_fpga (U11F.K3), 02_memory (U10M.H3 U11M.H4)
SRAM_A11: 01_fpga (U11F.R18), 02_memory (U10M.H2 U11M.H5)
SRAM_A12: 01_fpga (U11F.U16), 02_memory (U10M.G3 U11M.G3)
SRAM_A13: 01_fpga (U11F.K1), 02_memory (U10M.G2 U11M.G4)
SRAM_A14: 01_fpga (U11F.R5), 02_memory (U10M.F4 U11M.F3)
SRAM_A15: 01_fpga (U11F.T2), 02_memory (U10M.F3 U11M.F4)
SRAM_A16: 01_fpga (U11F.U1), 02_memory (U10M.E3 U11M.E4)
SRAM_A17: 01_fpga (U11F.N1), 02_memory (U10M.D3 U11M.D3)
SRAM_A18: 01_fpga (U11F.L5), 02_memory (U10M.H6 U11M.H1)
SRAM_A19: 01_fpga (U11F.K2), 02_memory (U10M.G4 U11M.G2)
SRAM_A20: 01_fpga (U11F.M18), 02_memory (U10M.H1 U11M.H6)
SRAM_A21: 01_fpga (U11F.T6), 02_memory (U10M.E4 U11M.E3)
SRAM_CE_N_1.8: 01_fpga (U16F.B1), 02_memory (R11M.2 U10M.B5 U11M.B5)
SRAM_D0: 01_fpga (U11F.M2), 02_memory (U10M.B6)
SRAM_D1: 01_fpga (U11F.R4), 02_memory (U10M.C5)
SRAM_D2: 01_fpga (U11F.P2), 02_memory (U10M.C6)
SRAM_D3: 01_fpga (U11F.L4), 02_memory (U10M.D5)
SRAM_D4: 01_fpga (U11F.L1), 02_memory (U10M.E5)
SRAM_D5: 01_fpga (U11F.M1), 02_memory (U10M.F5)
SRAM_D6: 01_fpga (U11F.R1), 02_memory (U10M.F6)
SRAM_D7: 01_fpga (U11F.P1), 02_memory (U10M.G6)
SRAM_D8: 01_fpga (U11F.U3), 02_memory (J14M.1 U10M.B1)
SRAM_D9: 01_fpga (U11F.V2), 02_memory (U10M.C1)
SRAM_D10: 01_fpga (U11F.V4), 02_memory (U10M.C2)
SRAM_D11: 01_fpga (U11F.U2), 02_memory (U10M.D2)
SRAM_D12: 01_fpga (U11F.N2), 02_memory (U10M.E2)
SRAM_D13: 01_fpga (U11F.T1), 02_memory (U10M.F2)
SRAM_D14: 01_fpga (U11F.K6), 02_memory (U10M.F1)
SRAM_D15: 01_fpga (U11F.J6), 02_memory (U10M.G1)
SRAM_D16: 01_fpga (U11F.V16), 02_memory (U11M.B6)
SRAM_D17: 01_fpga (U11F.V15), 02_memory (U11M.C5)
SRAM_D18: 01_fpga (U11F.U17), 02_memory (U11M.C6)
SRAM_D19: 01_fpga (U11F.U18), 02_memory (U11M.D5)
SRAM_D20: 01_fpga (U11F.P17), 02_memory (U11M.E5)
SRAM_D21: 01_fpga (U11F.T18), 02_memory (U11M.F5)
SRAM_D22: 01_fpga (U11F.P18), 02_memory (U11M.F6)
SRAM_D23: 01_fpga (U11F.M17), 02_memory (U11M.G6)
SRAM_D24: 01_fpga (U11F.N3), 02_memory (U11M.B1)
SRAM_D25: 01_fpga (U11F.T4), 02_memory (U11M.C1)
SRAM_D26: 01_fpga (U11F.V13), 02_memory (U11M.C2)
SRAM_D27: 01_fpga (U11F.P15), 02_memory (U11M.D2)
SRAM_D28: 01_fpga (U11F.T14), 02_memory (U11M.E2)
SRAM_D29: 01_fpga (U11F.R15), 02_memory (U11M.F2)
SRAM_D30: 01_fpga (U11F.T3), 02_memory (U11M.F1)
SRAM_D31: 01_fpga (U11F.R7), 02_memory (U11M.G1)
SRAM_DM0: 01_fpga (U11F.V3), 02_memory (U10M.A1)
SRAM_DM1: 01_fpga (U11F.R2), 02_memory (U10M.B2)
SRAM_DM2: 01_fpga (U11F.T5), 02_memory (U11M.A1)
SRAM_DM3: 01_fpga (U11F.T13), 02_memory (U11M.B2)
SRAM_OE_N: 01_fpga (U11F.U12), 02_memory (J16M.1 U10M.A2 U11M.A2)
SRAM_WE_N: 01_fpga (U11F.K4), 02_memory (J15M.1 U10M.G5 U11M.G5)
SRAM_ZZ_N_1.8: 01_fpga (U17F.B1), 02_memory (R10M.2 R12M.1 U10M.A6 U11M.A6)
SYS_ON: 03_power (Q12P.1 R26P.2), 05_kbd_pm (U11K.47)
T_TO_U_ON: 01_fpga (U11F.E18), 03_power (Q13P.1 R29P.1)
U_TO_T_ON: 01_fpga (Q13F.1 R28F.2), 05_kbd_pm (U11K.46)
UP5K_CIPO: 01_fpga (P12F.7), 05_kbd_pm (U10K.2 U11K.17)
UP5K_COPI: 01_fpga (P12F.6), 05_kbd_pm (U10K.5 U11K.14)
UP5K_CSN: 01_fpga (P12F.5), 05_kbd_pm (R11K.2 U10K.1 U11K.16)
UP5K_KEYCOL0: 01_fpga (P12F.19), 05_kbd_pm (U11K.48 U12K.9)
UP5K_KEYCOL1: 01_fpga (P12F.20), 05_kbd_pm (U11K.3 U12K.10)
UP5K_SCK: 01_fpga (P12F.8), 05_kbd_pm (R21K.2 U10K.6 U11K.15)
USB_N: 01_fpga (U11F.A3 U11F.B1), 03_power (R31P.2)
USB_P: 01_fpga (U11F.C1 U11F.C3), 03_power (R32P.2)
USBDN_PD: 01_fpga (U11F.A4), 03_power (R12P.2)
USBDN_PU: 01_fpga (U11F.B2), 03_power (R15P.2)
USBDP_PD: 01_fpga (U11F.C2), 03_power (R33P.2)
USBDP_PU: 01_fpga (U11F.D1), 03_power (R30P.2)
VBUS_DIV: 01_fpga (U11F.C4), 03_power (R27P.1 R28P.1)
VIBE_ON: 01_fpga (U11F.H15), 07_ux (Q12U.1 R27U.2)
WIFI_CIPO: 04_io (U10W.28), 05_kbd_pm (U11K.27)
WIFI_COPI: 04_io (U10W.27), 05_kbd_pm (U11K.28)
WIFI_CS: 04_io (U10W.31), 05_kbd_pm (U11K.32)
WIFI_LPCLK: 01_fpga (U11F.N15), 04_io (U10W.23 U11W.2), 05_kbd_pm (R24K.1)
WIFI_PA_ENABLE: 04_io (U10W.4), 05_kbd_pm (U11K.34)
WIFI_RES_N: 04_io (R10W.2 U10W.15), 05_kbd_pm (U11K.36)
WIFI_SCLK: 04_io (U10W.26), 05_kbd_pm (U11K.26)
WIFI_WIRQ: 04_io (U10W.29), 05_kbd_pm (U11K.31)
WIFI_WUP: 04_io (U10W.16), 05_kbd_pm (U11K.38)